# Altium schematic sheet RV1103.SchDoc
size A2; Author: NZY(SFerret); SheetNumber: 1; SheetTotal: 4
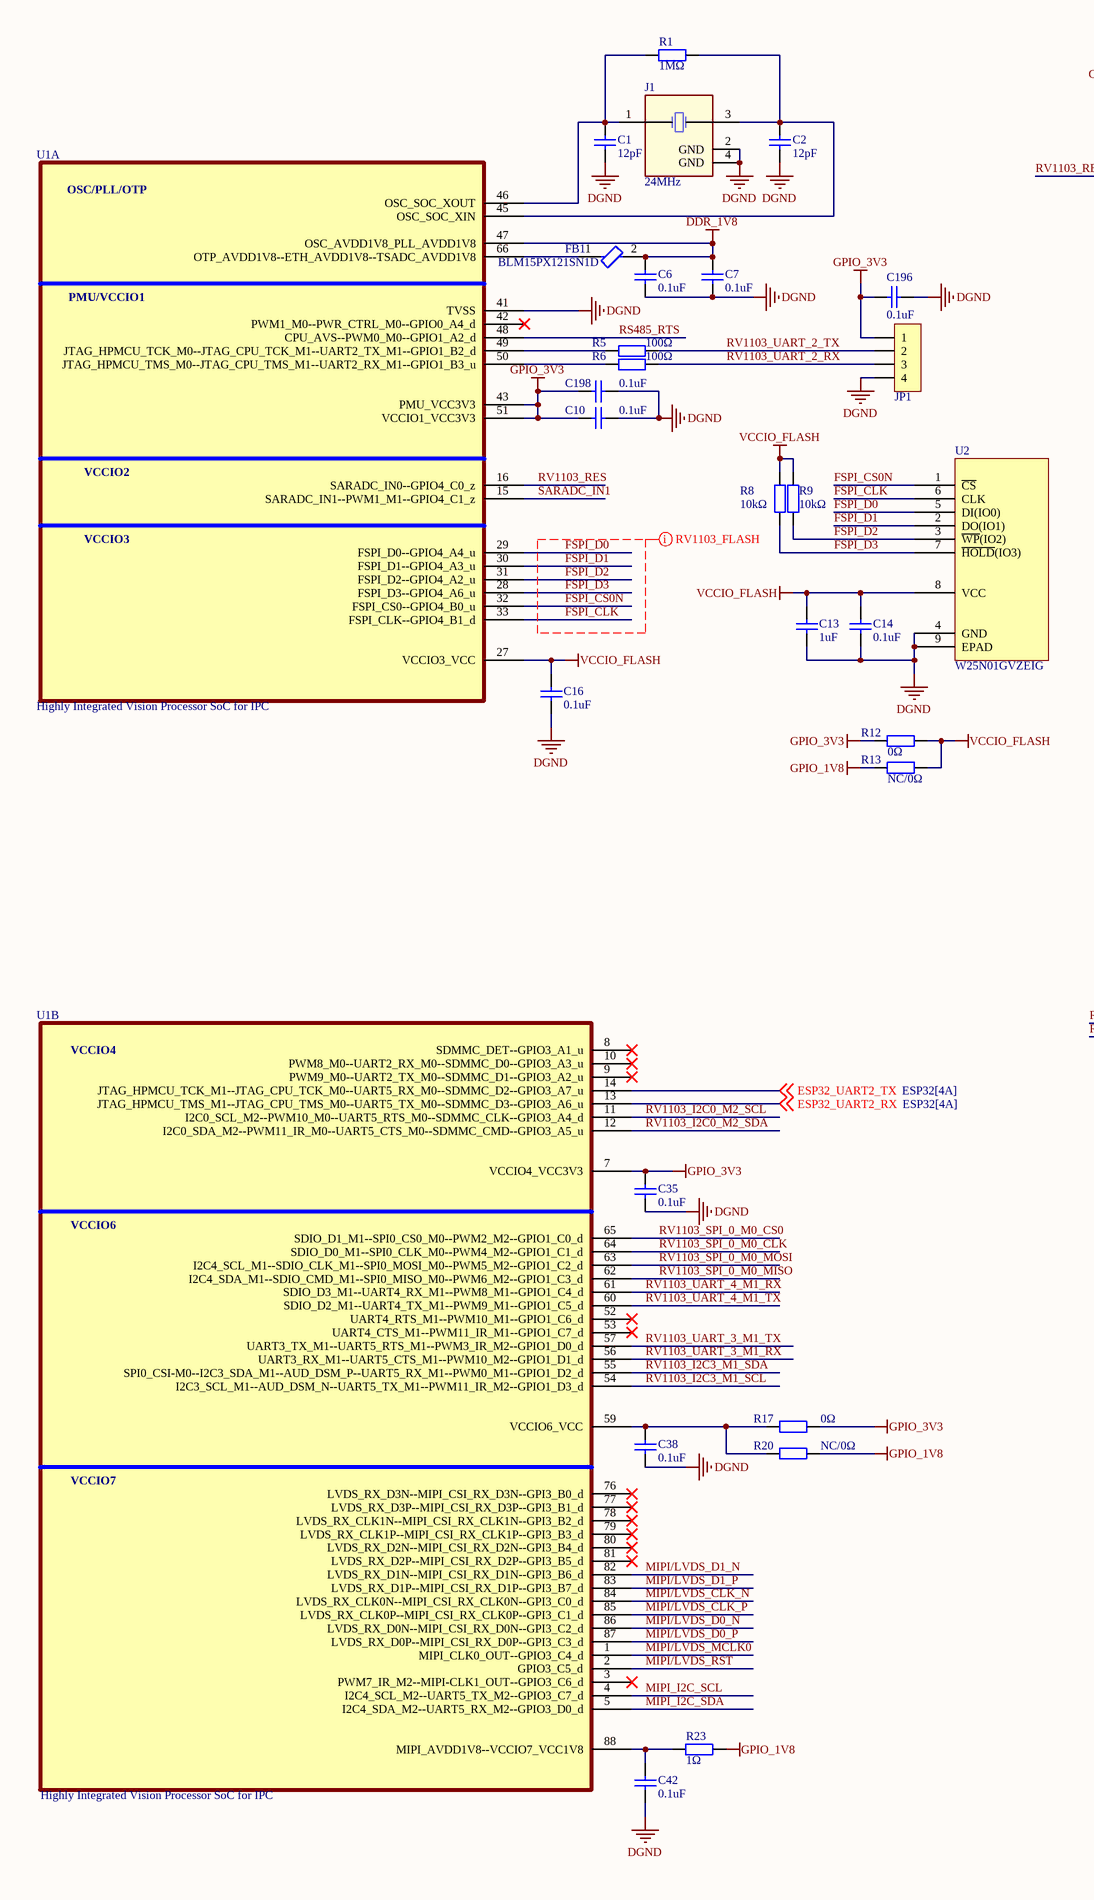
[diagram p0: RV1103.SchDoc, left]
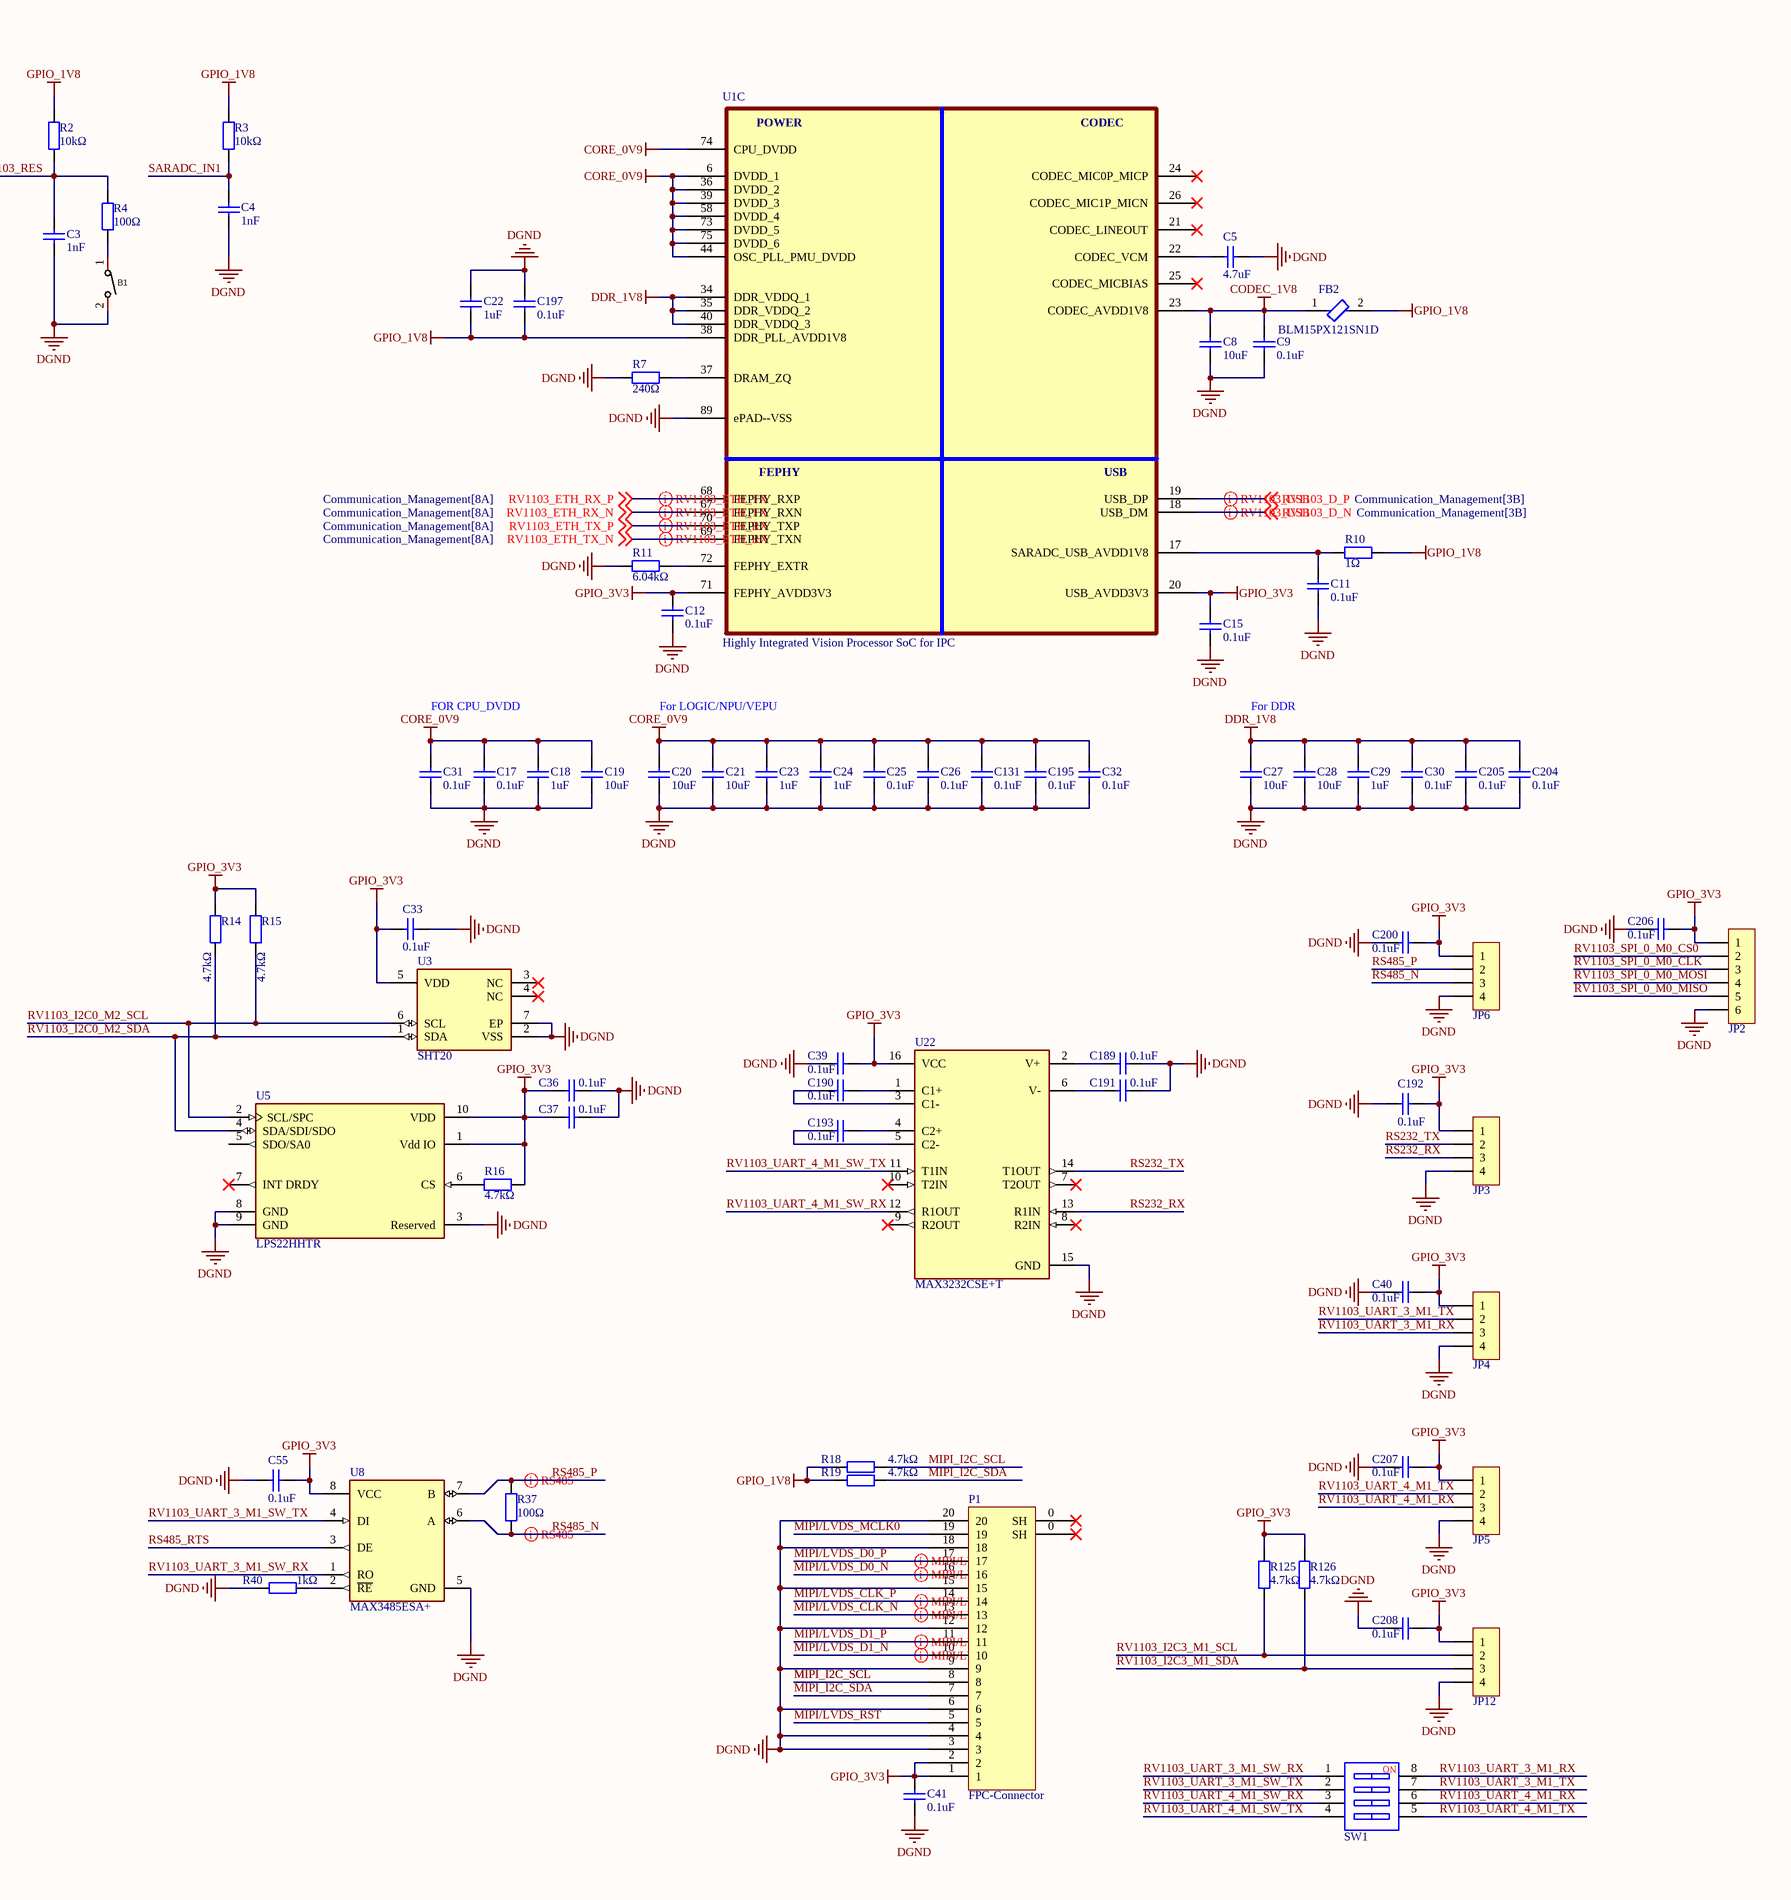
[diagram p1: RV1103.SchDoc, right]

## Parts
B1  Bottom-2P-1Way  [SW-SMD_L4.0-W2.9-LS5.0]  (value not drawn)
C1  12pF  [0402_C]
C2  12pF  [0402_C]
C3  1nF  [0402_C]
C4  1nF  [0402_C]
C5  4.7uF  [0402_C]
C6  0.1uF  [0402_C]
C7  0.1uF  [0402_C]
C8  10uF  [0402_C]
C9  0.1uF  [0402_C]
C10  0.1uF  [0402_C]
C11  0.1uF  [0402_C]
C12  0.1uF  [0402_C]
C13  1uF  [0603_C]
C14  0.1uF  [0603_C]
C15  0.1uF  [0402_C]
C16  0.1uF  [0402_C]
C17  0.1uF  [0402_C]
C18  1uF  [0402_C]
C19  10uF  [0603_C]
C20  10uF  [0603_C]
C21  10uF  [0603_C]
C22  1uF  [0402_C]
C23  1uF  [0402_C]
C24  1uF  [0402_C]
C25  0.1uF  [0402_C]
C26  0.1uF  [0402_C]
C27  10uF  [0603_C]
C28  10uF  [0603_C]
C29  1uF  [0402_C]
C30  0.1uF  [0402_C]
C31  0.1uF  [0402_C]
C32  0.1uF  [0402_C]
C33  0.1uF  [0603_C]
C35  0.1uF  [0402_C]
C36  0.1uF  [0603_C]
C37  0.1uF  [0603_C]
C38  0.1uF  [0402_C]
C39  0.1uF  [0603_C]
C40  0.1uF  [0603_C]
C41  0.1uF  [0603_C]
C42  0.1uF  [0402_C]
C55  0.1uF  [0603_C]
C131  0.1uF  [0402_C]
C189  0.1uF  [0603_C]
C190  0.1uF  [0603_C]
C191  0.1uF  [0603_C]
C192  0.1uF  [0603_C]
C193  0.1uF  [0603_C]
C195  0.1uF  [0402_C]
C196  0.1uF  [0603_C]
C197  0.1uF  [0402_C]
C198  0.1uF  [0402_C]
C200  0.1uF  [0603_C]
C204  0.1uF  [0402_C]
C205  0.1uF  [0402_C]
C206  0.1uF  [0603_C]
C207  0.1uF  [0603_C]
C208  0.1uF  [0603_C]
FB1  BLM15PX121SN1D  [FP-BLM15-0_05-d0_7-MFG]
FB2  BLM15PX121SN1D  [FP-BLM15-0_05-d0_7-MFG]
J1  24MHz  [SMD-2520_4P]
JP1  HDR-1X4  [MX 1.25-LS-4P]  (value not drawn)
JP2  HDR-1X6  [MX 1.25-LS-6P]  (value not drawn)
JP3  HDR-1X4  [MX 1.25-LS-4P]  (value not drawn)
JP4  HDR-1X4  [MX 1.25-LS-4P]  (value not drawn)
JP5  HDR-1X4  [MX 1.25-LS-4P]  (value not drawn)
JP6  HDR-1X4  [MX 1.25-LS-4P]  (value not drawn)
JP12  HDR-1X4  [MX 1.25-LS-4P]  (value not drawn)
P1  FPC-Connector  [FPC0.5 2H-WS-20P]
R1  1MΩ  [0402_R]
R2  10kΩ  [0402_R]
R3  10kΩ  [0402_R]
R4  100Ω  [0402_R]
R5  100Ω  [0402_R]
R6  100Ω  [0402_R]
R7  240Ω  [0402_R]
R8  10kΩ  [0603_R]
R9  10kΩ  [0603_R]
R10  1Ω  [0402_R]
R11  6.04kΩ  [0402_R]
R12  0Ω  [0402_R]
R13  NC/0Ω  [0402_R]
R14  4.7kΩ  [0603_R]
R15  4.7kΩ  [0603_R]
R16  4.7kΩ  [0603_R]
R17  0Ω  [0402_R]
R18  4.7kΩ  [0402_R]
R19  4.7kΩ  [0402_R]
R20  NC/0Ω  [0402_R]
R23  1Ω  [0402_R]
R37  100Ω  [0805_R]
R40  1kΩ  [0603_R]
R125  4.7kΩ  [0402_R]
R126  4.7kΩ  [0402_R]
SW1  SW-4P  [CSW1.27 SMD-4P]  (value not drawn)
U1  Highly Integrated Vision Processor SoC for IPC  [QFN35P900X900X95_HS-89N]  (parts A,B,C of 3)
U2  W25N01GVZEIG  [WSON-8_8X6_WIN]
U3  SHT20  [FP-SHT20-MFG]
U5  LPS22HHTR  [FP-HLGA-10L-DM00386636-MFG]
U8  MAX3485ESA+  [FP-S8-5-MFG]
U22  MAX3232CSE+T  [FP-S16-1-MFG]

## Nets
CODEC_1V8: C8.2 C9.2 FB2.1 U1.23(CODEC_AVDD1V8)
CORE_0V9: C17.2 C18.2 C19.2 C20.2 C21.2 C23.2 C24.2 C25.2 C26.2 C31.2 C32.2 C131.2 C195.2 U1.6(DVDD_1) U1.36(DVDD_2) U1.39(DVDD_3) U1.44(OSC_PLL_PMU_DVDD) U1.58(DVDD_4) U1.73(DVDD_5) U1.74(CPU_DVDD) U1.75(DVDD_6)
DDR_1V8: C6.1 C7.1 C27.2 C28.2 C29.2 C30.2 C204.2 C205.2 FB1.2 U1.34(DDR_VDDQ_1) U1.35(DDR_VDDQ_2) U1.40(DDR_VDDQ_3) U1.47(OSC_AVDD1V8_PLL_AVDD1V8)
DGND: B1.2 C1.1 C2.1 C3.1 C4.1 C5.2 C6.2 C7.2 C8.1 C9.1 C10.1 C11.1 C12.1 C13.1 C14.1 C15.1 C16.1 C17.1 C18.1 C19.1 C20.1 C21.1 C22.2 C23.1 C24.1 C25.1 C26.1 C27.1 C28.1 C29.1 C30.1 C31.1 C32.1 C33.2 C35.1 C36.2 C37.2 C38.1 C39.2 C40.2 C41.1 C42.1 C55.1 C131.1 C189.2 C191.2 C192.2 C195.1 C196.2 C197.2 C198.1 C200.1 C204.1 C205.1 C206.1 C207.2 C208.2 J1.2(GND) J1.4(GND) JP1.4 JP2.6 JP3.4 JP4.4 JP5.4 JP6.4 JP12.4 P1.3 P1.4 P1.6 P1.9 P1.12 P1.15 P1.18 P1.20 R7.1 R11.1 R40.2 U1.41(TVSS) U1.89(ePAD--VSS) U2.4(GND) U2.9(EPAD) U3.2(VSS) U3.7(EP) U5.3(Reserved) U5.8(GND) U5.9(GND) U8.5(GND) U22.15(GND)
GPIO_1V8: C22.1 C197.1 FB2.2 R2.2 R3.2 R10.2 R13.1 R18.2 R19.2 R20.2 R23.2 U1.38(DDR_PLL_AVDD1V8)
GPIO_3V3: C10.2 C12.2 C15.2 C33.1 C35.2 C36.1 C37.1 C39.1 C40.1 C41.2 C55.2 C192.1 C196.1 C198.2 C200.2 C206.2 C207.1 C208.1 JP1.1 JP2.1 JP3.1 JP4.1 JP5.1 JP6.1 JP12.1 P1.1 P1.2 R12.1 R14.2 R15.2 R16.1 R17.2 R125.2 R126.2 U1.7(VCCIO4_VCC3V3) U1.20(USB_AVDD3V3) U1.43(PMU_VCC3V3) U1.51(VCCIO1_VCC3V3) U1.71(FEPHY_AVDD3V3) U3.5(VDD) U5.1(Vdd_IO) U5.10(VDD) U8.8(VCC) U22.16(VCC)
VCCIO_FLASH: C13.2 C14.2 C16.2 R8.2 R9.2 R12.2 R13.2 U1.27(VCCIO3_VCC) U2.8(VCC)
ESP32_UART2_RX: U1.13(JTAG_HPMCU_TMS_M1--JTAG_CPU_TMS_M0--UART5_TX_M0--SDMMC_D3--GPIO3_A6_u) ; off-sheet ESP32_UART2_RX
ESP32_UART2_TX: U1.14(JTAG_HPMCU_TCK_M1--JTAG_CPU_TCK_M0--UART5_RX_M0--SDMMC_D2--GPIO3_A7_u) ; off-sheet ESP32_UART2_TX
FSPI_CLK: U1.33(FSPI_CLK--GPIO4_B1_d) U2.6(CLK)
FSPI_CS0N: U1.32(FSPI_CS0--GPIO4_B0_u) U2.1(~{CS})
FSPI_D0: U1.29(FSPI_D0--GPIO4_A4_u) U2.5(DI(IO0))
FSPI_D1: U1.30(FSPI_D1--GPIO4_A3_u) U2.2(DO(IO1))
FSPI_D2: R9.1 U1.31(FSPI_D2--GPIO4_A2_u) U2.3(~{WP}(IO2))
FSPI_D3: R8.1 U1.28(FSPI_D3--GPIO4_A6_u) U2.7(~{HOLD}(IO3))
MIPI/LVDS_CLK_N: P1.13 U1.84(LVDS_RX_CLK0N--MIPI_CSI_RX_CLK0N--GPI3_C0_d)
MIPI/LVDS_CLK_P: P1.14 U1.85(LVDS_RX_CLK0P--MIPI_CSI_RX_CLK0P--GPI3_C1_d)
MIPI/LVDS_D0_N: P1.16 U1.86(LVDS_RX_D0N--MIPI_CSI_RX_D0N--GPI3_C2_d)
MIPI/LVDS_D0_P: P1.17 U1.87(LVDS_RX_D0P--MIPI_CSI_RX_D0P--GPI3_C3_d)
MIPI/LVDS_D1_N: P1.10 U1.82(LVDS_RX_D1N--MIPI_CSI_RX_D1N--GPI3_B6_d)
MIPI/LVDS_D1_P: P1.11 U1.83(LVDS_RX_D1P--MIPI_CSI_RX_D1P--GPI3_B7_d)
MIPI/LVDS_MCLK0: P1.19 U1.1(MIPI_CLK0_OUT--GPIO3_C4_d)
MIPI/LVDS_RST: P1.5 U1.2(GPIO3_C5_d)
MIPI_I2C_SCL: P1.8 R18.1 U1.4(I2C4_SCL_M2--UART5_TX_M2--GPIO3_C7_d)
MIPI_I2C_SDA: P1.7 R19.1 U1.5(I2C4_SDA_M2--UART5_RX_M2--GPIO3_D0_d)
RS232_RX: JP3.3 U22.13(R1IN)
RS232_TX: JP3.2 U22.14(T1OUT)
RS485_N: JP6.3 R37.1 U8.6(A)
RS485_P: JP6.2 R37.2 U8.7(B)
RS485_RTS: U1.48(CPU_AVS--PWM0_M0--GPIO1_A2_d) U8.3(DE)
RV1103_D_N: U1.18(USB_DM) ; off-sheet RV1103_D_N
RV1103_D_P: U1.19(USB_DP) ; off-sheet RV1103_D_P
RV1103_ETH_RX_N: U1.67(FEPHY_RXN) ; off-sheet RV1103_ETH_RX_N
RV1103_ETH_RX_P: U1.68(FEPHY_RXP) ; off-sheet RV1103_ETH_RX_P
RV1103_ETH_TX_N: U1.69(FEPHY_TXN) ; off-sheet RV1103_ETH_TX_N
RV1103_ETH_TX_P: U1.70(FEPHY_TXP) ; off-sheet RV1103_ETH_TX_P
RV1103_I2C0_M2_SCL: R15.1 U1.11(I2C0_SCL_M2--PWM10_M0--UART5_RTS_M0--SDMMC_CLK--GPIO3_A4_d) U3.6(SCL) U5.2(SCL/SPC)
RV1103_I2C0_M2_SDA: R14.1 U1.12(I2C0_SDA_M2--PWM11_IR_M0--UART5_CTS_M0--SDMMC_CMD--GPIO3_A5_u) U3.1(SDA) U5.4(SDA/SDI/SDO)
RV1103_I2C3_M1_SCL: JP12.2 R125.1 U1.54(I2C3_SCL_M1--AUD_DSM_N--UART5_TX_M1--PWM11_IR_M2--GPIO1_D3_d)
RV1103_I2C3_M1_SDA: JP12.3 R126.1 U1.55(SPI0_CSI-M0--I2C3_SDA_M1--AUD_DSM_P--UART5_RX_M1--PWM0_M1--GPIO1_D2_d)
RV1103_RES: C3.2 R2.1 R4.2 U1.16(SARADC_IN0--GPIO4_C0_z)
RV1103_SPI_0_M0_CLK: JP2.3 U1.64(SDIO_D0_M1--SPI0_CLK_M0--PWM4_M2--GPIO1_C1_d)
RV1103_SPI_0_M0_CS0: JP2.2 U1.65(SDIO_D1_M1--SPI0_CS0_M0--PWM2_M2--GPIO1_C0_d)
RV1103_SPI_0_M0_MISO: JP2.5 U1.62(I2C4_SDA_M1--SDIO_CMD_M1--SPI0_MISO_M0--PWM6_M2--GPIO1_C3_d)
RV1103_SPI_0_M0_MOSI: JP2.4 U1.63(I2C4_SCL_M1--SDIO_CLK_M1--SPI0_MOSI_M0--PWM5_M2--GPIO1_C2_d)
RV1103_UART_2_RX: JP1.3 R6.2
RV1103_UART_2_TX: JP1.2 R5.2
RV1103_UART_3_M1_RX: JP4.3 SW1.8 U1.56(UART3_RX_M1--UART5_CTS_M1--PWM10_M2--GPIO1_D1_d)
RV1103_UART_3_M1_SW_RX: SW1.1 U8.1(RO)
RV1103_UART_3_M1_SW_TX: SW1.2 U8.4(DI)
RV1103_UART_3_M1_TX: JP4.2 SW1.7 U1.57(UART3_TX_M1--UART5_RTS_M1--PWM3_IR_M2--GPIO1_D0_d)
RV1103_UART_4_M1_RX: JP5.3 SW1.6 U1.61(SDIO_D3_M1--UART4_RX_M1--PWM8_M1--GPIO1_C4_d)
RV1103_UART_4_M1_SW_RX: SW1.3 U22.12(R1OUT)
RV1103_UART_4_M1_SW_TX: SW1.4 U22.11(T1IN)
RV1103_UART_4_M1_TX: JP5.2 SW1.5 U1.60(SDIO_D2_M1--UART4_TX_M1--PWM9_M1--GPIO1_C5_d)
SARADC_IN1: C4.2 R3.1 U1.15(SARADC_IN1--PWM1_M1--GPIO4_C1_z)
NetB1_1: B1.1 R4.1
NetC1_2: C1.2 J1.1(OSC1) R1.1 U1.46(OSC_SOC_XOUT)
NetC2_2: C2.2 J1.3(OSC2) R1.2 U1.45(OSC_SOC_XIN)
NetC5_1: C5.1 U1.22(CODEC_VCM)
NetC11_2: C11.2 R10.1 U1.17(SARADC_USB_AVDD1V8)
NetC38_2: C38.2 R17.1 R20.1 U1.59(VCCIO6_VCC)
NetC42_2: C42.2 R23.1 U1.88(MIPI_AVDD1V8--VCCIO7_VCC1V8)
NetC189_1: C189.1 U22.2(V+)
NetC190_1: C190.1 U22.3(C1-)
NetC190_2: C190.2 U22.1(C1+)
NetC191_1: C191.1 U22.6(V-)
NetC193_1: C193.1 U22.5(C2-)
NetC193_2: C193.2 U22.4(C2+)
NetFB1_1: FB1.1 U1.66(OTP_AVDD1V8--ETH_AVDD1V8--TSADC_AVDD1V8)
NetR5_1: R5.1 U1.49(JTAG_HPMCU_TCK_M0--JTAG_CPU_TCK_M1--UART2_TX_M1--GPIO1_B2_d)
NetR6_1: R6.1 U1.50(JTAG_HPMCU_TMS_M0--JTAG_CPU_TMS_M1--UART2_RX_M1--GPIO1_B3_u)
NetR7_2: R7.2 U1.37(DRAM_ZQ)
NetR11_2: R11.2 U1.72(FEPHY_EXTR)
NetR16_2: R16.2 U5.6(CS)
NetR40_1: R40.1 U8.2(~{RE})

Not connected (* = marked no-connect by the designer): P1 0(SH)*; U1 3(PWM7_IR_M2--MIPI-CLK1_OUT--GPIO3_C6_d)* 8(SDMMC_DET--GPIO3_A1_u)* 9(PWM9_M0--UART2_TX_M0--SDMMC_D1--GPIO3_A2_u)* 10(PWM8_M0--UART2_RX_M0--SDMMC_D0--GPIO3_A3_u)* 21(CODEC_LINEOUT)* 24(CODEC_MIC0P_MICP)* 25(CODEC_MICBIAS)* 26(CODEC_MIC1P_MICN)* 42(PWM1_M0--PWR_CTRL_M0--GPIO0_A4_d)* 52(UART4_RTS_M1--PWM10_M1--GPIO1_C6_d)* 53(UART4_CTS_M1--PWM11_IR_M1--GPIO1_C7_d)* 76(LVDS_RX_D3N--MIPI_CSI_RX_D3N--GPI3_B0_d)* 77(LVDS_RX_D3P--MIPI_CSI_RX_D3P--GPI3_B1_d)* 78(LVDS_RX_CLK1N--MIPI_CSI_RX_CLK1N--GPI3_B2_d)* 79(LVDS_RX_CLK1P--MIPI_CSI_RX_CLK1P--GPI3_B3_d)* 80(LVDS_RX_D2N--MIPI_CSI_RX_D2N--GPI3_B4_d)* 81(LVDS_RX_D2P--MIPI_CSI_RX_D2P--GPI3_B5_d)*; U3 3(NC)* 4(NC)*; U5 5(SDO/SA0) 7(INT_DRDY)*; U22 7(T2OUT)* 8(R2IN)* 9(R2OUT)* 10(T2IN)*

## Layout directives
differential pair: MIPI/LVDS_CLK_N, MIPI/LVDS_CLK_P, MIPI/LVDS_D0_N, MIPI/LVDS_D0_P, MIPI/LVDS_D1_N, MIPI/LVDS_D1_P, RS485_N, RS485_P, RV1103_D_N, RV1103_D_P, RV1103_ETH_RX_N, RV1103_ETH_RX_P, RV1103_ETH_TX_N, RV1103_ETH_TX_P
net class RV1103_FLASH: FSPI_CLK, FSPI_CS0N, FSPI_D0, FSPI_D1, FSPI_D2, FSPI_D3

## Notes on the sheet
- FOR CPU_DVDD
- For LOGIC/NPU/VEPU
- For DDR
- (in symbol RV1103G, part A) OSC/PLL/OTP; PMU/VCCIO1; VCCIO2; VCCIO3
- (in symbol RV1103G, part B) VCCIO4; VCCIO6; VCCIO7
- (in symbol RV1103G, part C) POWER; CODEC; FEPHY; USB
- (in symbol SW-4P) NO

## Library data of the parts
B1 = Bottom-2P-1Way: 轻触按键; Manufacturer: SHOU HAN(首韩); Symbol: TS342A2P-WZ; Add into BOM: yes; Device: TS342A2P-WZ; LCSC Part Name: 轻触开关 3*4*2 两脚小龟不带柱 250gf 黑色塑胶按钮; Supplier Part: C557591; Manufacturer Part: TS342A2P-WZ; Supplier Footprint: SMD; JLCPCB Part Class: Extended Part; Datasheet: https://atta.szlcsc.com/upload/public/pdf/source/20200519/C557591_B3A5A21584733303F06306F18577DA8B.pdf; Supplier: LCSC; Convert to PCB: yes
C1-C33 C35-C42 C55 C131 C189-C193 C195-C198 C200 C204-C208 = SMT_Cap: 贴片电容; ComponentLink1Description: 供应商链接; ComponentLink1URL: http://www.szlcsc.com/product/details_29010.html; Package: 0805; Supplier: LC; SuppliersPartNumber: C28260
FB1 FB2 = CMP-0686-00133-3: Chip Ferrite Bead, 0402, 120Ω @ 100MHz, 0.055Ω, 25%, 2A; Impedance: 120R; DC Resistance (DCR): 55mR; Number of Circuits: 1; Material: Steel; Lead Free: Lead Free; Package Quantity: 10000; Width: 0.5mm; Case Code (Metric): 1005; Test Frequency: 100MHz; Weight: 2.3E-05oz; Max DC Current: 2A; Current Rating: 2A; REACH SVHC: No SVHC; Case Code (Imperial): 0402; Min Operating Temperature: -55°C; Max Operating Temperature: 125°C; Max Current Rating: 2A; Series: EMIFIL®, BLM15P; Tolerance: 25%; Termination: SMD/SMT; Number of Lines: 1; Case/Package: 0402; RoHS Compliant: Yes; Number of Pins: 2; Length: 1mm; Height: 0.5mm; Packaging: Tape and Reel
J1 = Oscillator_SMT_4P
JP1 JP3-JP6 JP12 = Header 4: 4P接插件; 卖家免费技术支持，联系售后: 唯一出售店铺网址https://shop463601444.taobao.com; 封装库来自淘宝卖家 ID：黄晶宝石: 其他店铺购入均为假冒，请申请退款，本店现金奖励; 优秀评价可免费更新封装库: 联系淘宝ID：黄晶宝石，获取更新版封装库; BOM名称: 4P接插件
JP2 = Header 6: 6P接插件; 卖家免费技术支持，联系售后: 唯一出售店铺网址https://shop463601444.taobao.com; 封装库来自淘宝卖家 ID：黄晶宝石: 其他店铺购入均为假冒，请申请退款，本店现金奖励; 优秀评价可免费更新封装库: 联系淘宝ID：黄晶宝石，获取更新版封装库; BOM名称: 6P接插件
P1 = FFC/FPC-0.5-WS-20
R1-R20 R23 R37 R40 R125 R126 = SMT_Res: 贴片电阻; ComponentLink1Description: 供应商链接; ComponentLink1URL: http://www.szlcsc.com/product/details_23980.html; Package: 0603; Supplier: LC; SuppliersPartNumber: C23253
SW1 = SW-4P: 4路编码开关; 免费技术支持，联系售后: 唯一出售店铺网址https://shop463601444.taobao.com; 封装库来自淘宝卖家 ID：黄晶宝石: 其他店铺购入均为盗版假冒封装库，请立即申请退款，本店3~10元现金奖励; BOM名称: 4路编码开关
U1 = RV1103G: RV1103 is a highly integrated vision processor SoC for IPC, especially for AI related / applications.
U2 = W25N01GVZEIG: 1G-BIT SPI FLASH
U3 = CMP-2000-05344-2: SENSOR HUMID/TEMP 3V I2C 3% SMD; Manufacturer: Sensirion; Min Supply Voltage: 2.1V; Automotive Grade: Grade 1; Max Supply Voltage: 3.6V; Operating Supply Current: 300uA; Resolution: 14bits; Device Class L2: Temperature and Humidity Sensors; Ipc Land Pattern Name: DFN300X300X110-6; Category: IC; Device Class L3: unset; Accuracy: 3%; ComponentLink2URL: https://www.sensirion.com/fileadmin/user_upload/customers/sensirion/Dokumente/0_Datasheets/Humidity/Sensirion_Humidity_Sensors_SHT20_Datasheet.pdf; Temperature: -40°C to +125°C; Interface: I2C; Lead Free: Yes; Temperature Range High: +125°C; Automotive: Yes; Device Class L1: Sensors; Height: 1.1mm; Temperature Range Low: -40°C; ComponentLink2Description: Datasheet; Octopart: https://octopart.com/sht20-sensirion-47077745; Sensor Output: I2C; Manufacturer Part Number: SHT20; Package: 0; Digikey Description: SENSOR HUMID/TEMP 3V I2C 3% SMD; RoHS: TRUE
U5 = CMP-12182-000001-1: CONSUMER MEMS; Manufacturer: STMicroelectronics; Operating Supply Current: 4-12uA; Sensor Output: I2C,SPI; Port Style: No Port; Min Supply Voltage: 1.7V; Max Supply Voltage: 3.7V; Package: HLGA-10L-DM00386636; Temperature Range Low: -40°C; RoHS: TRUE; Device Class L1: Sensors; Automotive: No; Manufacturer Part Number: LPS22HHTR; ComponentLink2URL: https://www.st.com/resource/en/datasheet/lps22hh.pdf; Temperature: -40°C to +85°C; Category: IC; Device Class L3: unset; ComponentLink2Description: Datasheet; Lead Free: Yes; Temperature Range High: +85°C; Octopart: https://octopart.com/lps22hhtr-stmicroelectronics-94834025; Footprint Url: https://www.st.com/content/ccc/resource/technical/document/technical_note/73/17/9c/16/dd/96/4a/01/CD00134799.pdf/files/CD00134799.pdf/jcr:content/translations/en.CD00134799.pdf; Height: 0.8mm; Device Class L2: Pressure Sensors; Digikey Description: CONSUMER MEMS
U8 = CMP-05679-000020-1: IC TXRX RS485/422 10MBPS 8SOIC; Manufacturer: Maxim Integrated; Nominal Supply Current: 0.95-1.1mA; Data Rate: 10Mbits/s; Min Supply Voltage: 3V; Interface: RS-485,RS-422; Number Of Transmitters: 1; Max Supply Voltage: 3.6V; Max Junction Temp: +160°C; Standoff Height: 0.1mm; Simplex Duplex: Half Duplex; Height: 1.75mm; Temperature Range High: +85°C; Device Class L2: Interface ICs; Digikey Description: IC TXRX RS485/422 10MBPS 8SOIC; Temperature: -40°C to +85°C; Device Class L3: RS-232 / RS-422 / RS-485 Interface ICs; Temperature Range Low: -40°C; Footprint Url: https://pdfserv.maximintegrated.com/land_patterns/90-0096.PDF; Category: IC; ComponentLink2URL: https://datasheets.maximintegrated.com/en/ds/MAX3483-MAX3491.pdf; Package: S8-5; Octopart: https://octopart.com/max3485esa%2B-maxim+integrated-39731860; RoHS: TRUE; Manufacturer Part Number: MAX3485ESA+; Lead Free: Yes; ComponentLink2Description: Datasheet; Device Class L1: Integrated Circuits (ICs); Mouser Description: 3.3V Powered, 10Mbps and Slew-Rate Limited, True RS-485/RS-422 Transceivers; Number Of Receivers: 1; Automotive: No
U22 = CMP-2000-06662-2: IC TXRX RS-232 LP 16SOIC; Manufacturer: Maxim Integrated; Nominal Supply Current: 0.3mA; Max Supply Voltage: 5.5V; Number Of Transmitters: 2; Simplex Duplex: Full Duplex; Min Supply Voltage: 3V; Data Rate: 235kbits/s; Standoff Height: 0.1mm; ComponentLink2URL: https://www.maximintegrated.com/en/ds/MAX3222-MAX3241.pdf; Device Class L2: Interface ICs; Interface: RS-232; RoHS: TRUE; Octopart: https://octopart.com/max3232cse%2Bt-maxim+integrated-39731899; Category: IC; Device Class L3: RS-232 / RS-422 / RS-485 Interface ICs; Automotive: No; Mouser Description: RS-232 Interface IC 3-5.5V 235kbps Transceiver; Temperature Range High: +70°C; Manufacturer Part Number: MAX3232CSE+T; Number Of Receivers: 2; Digikey Description: IC TXRX RS-232 LP 16SOIC; ComponentLink2Description: Datasheet; Temperature Range Low: 0°C; Footprint Url: https://pdfserv.maximintegrated.com/land_patterns/90-0097.PDF; Device Class L1: Integrated Circuits (ICs); Ipc Land Pattern Name: SOIC127P600X155-16; Lead Free: Yes; Package: S16-1; Height: 1.75mm; Temperature: 0°C to +70°C